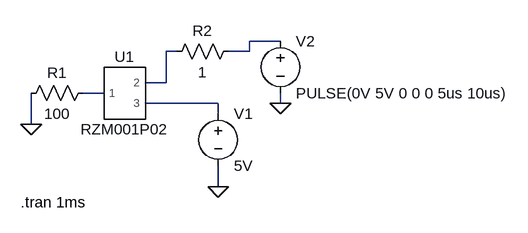
[diagram p0: schematic RZM001P02 test.asc]
RZM001P02 test.asc, the LTspice schematic file:
Version 4
SHEET 1 880 680
WIRE 416 64 368 64
WIRE 256 80 240 80
WIRE 368 80 368 64
WIRE 368 80 336 80
WIRE 240 128 240 80
WIRE 240 128 208 128
WIRE 144 144 112 144
WIRE 320 160 208 160
WIRE 416 160 416 144
WIRE 320 176 320 160
WIRE 32 192 32 144
WIRE 320 288 320 256
FLAG 320 288 0
FLAG 32 192 0
FLAG 416 160 0
SYMBOL AutoGenerated\\RZM001P02 176 144 R0
SYMATTR InstName U1
SYMBOL voltage 320 160 R0
WINDOW 123 0 0 Left 0
WINDOW 39 0 0 Left 0
SYMATTR InstName V1
SYMATTR Value 5V
SYMBOL res 128 128 R90
WINDOW 0 0 56 VBottom 2
WINDOW 3 32 56 VTop 2
SYMATTR InstName R1
SYMATTR Value 100
SYMBOL voltage 416 48 R0
WINDOW 123 0 0 Left 0
WINDOW 39 0 0 Left 0
SYMATTR InstName V2
SYMATTR Value PULSE(0V 5V 0 0 0 5us 10us)
SYMBOL res 352 64 R90
WINDOW 0 0 56 VBottom 2
WINDOW 3 32 56 VTop 2
SYMATTR InstName R2
SYMATTR Value 1
TEXT 16 312 Left 2 !.tran 1ms

The netlist it stands for:
* RZM001P02 test.asc
XU1 N003 N002 N004 RZM001P02  ; pins 1 2 3
V1 N004 0 5V
R1 N003 0 100
V2 N001 0 PULSE(0V 5V 0 0 0 5us 10us)
R2 N001 N002 1
.tran 1ms
.lib D:\Projekte\ELController\ltspice model\rzm001p02_spice\rzm001p02.lib
.backanno
.end